# Altium schematic sheet Pizza IO.SchDoc: Pizza CHALLENGES
size A4; Author: Giovanni Minotti; SheetNumber: 2; SheetTotal: 2
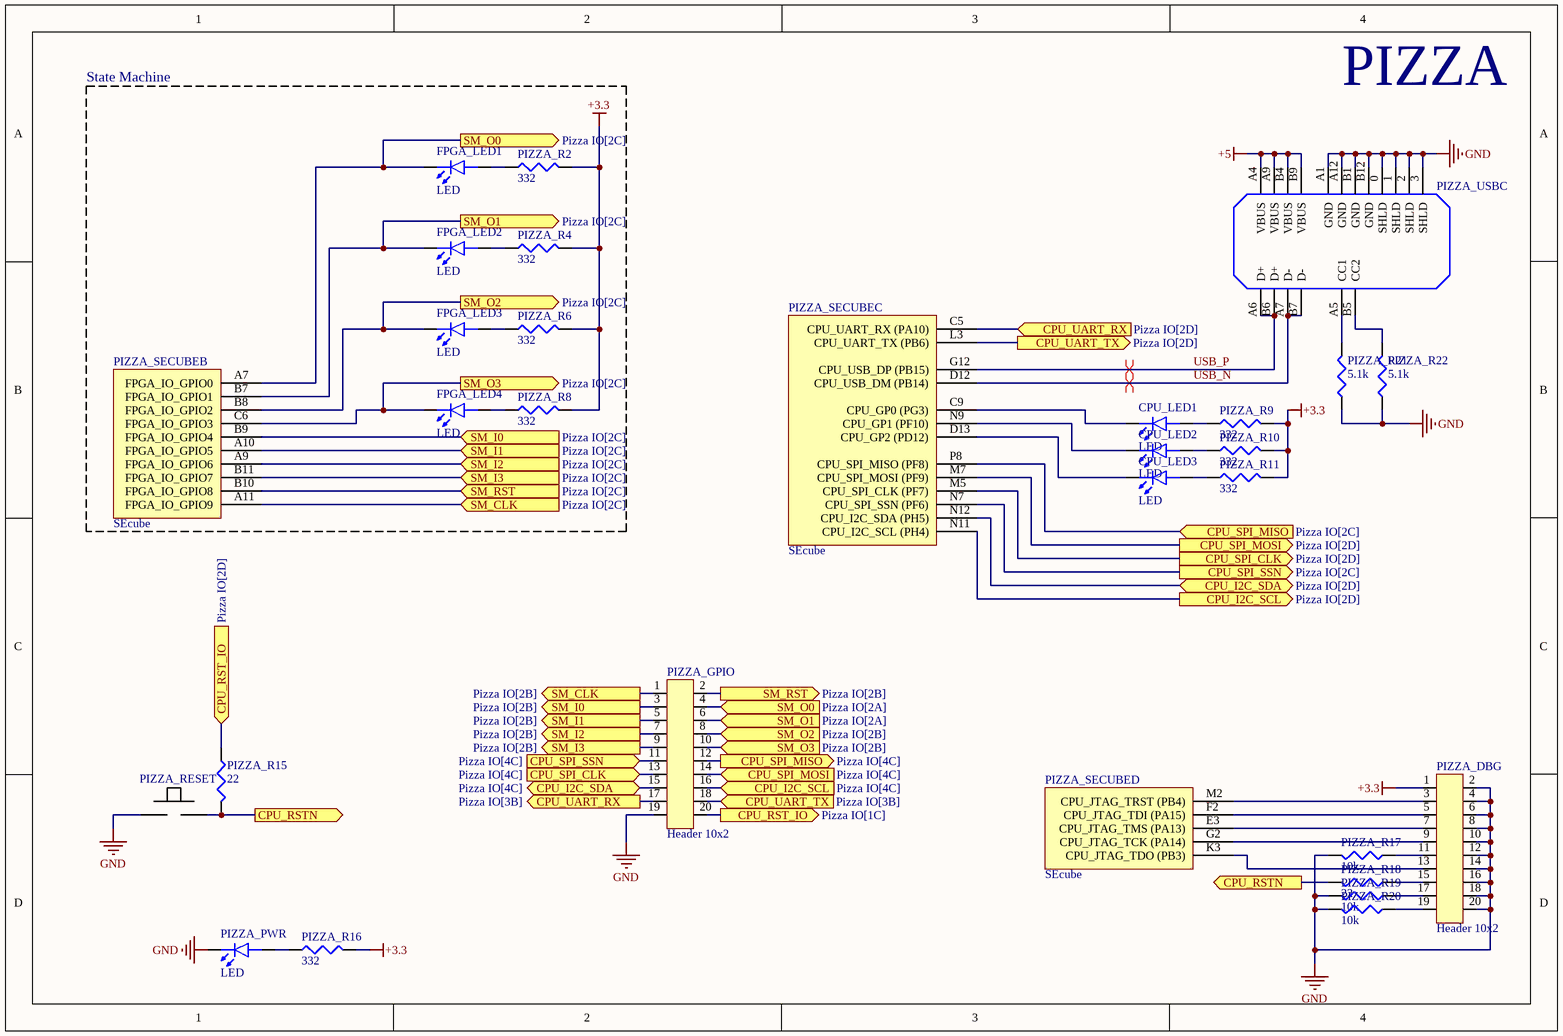
[diagram p0: Pizza IO.SchDoc]

## Parts
CPU_LED1  LED  [LED0603P]
CPU_LED2  LED  [LED0603P]
CPU_LED3  LED  [LED0603P]
FPGA_LED1  LED  [LED0603P]
FPGA_LED2  LED  [LED0603P]
FPGA_LED3  LED  [LED0603P]
FPGA_LED4  LED  [LED0603P]
PIZZA_DBG  Header 10x2  [HEADER10x2]
PIZZA_GPIO  Header 10x2  [HEADER10x2]
PIZZA_PWR  LED  [LED0603P]
PIZZA_R2  332  [R0402]
PIZZA_R4  332  [R0402]
PIZZA_R6  332  [R0402]
PIZZA_R8  332  [R0402]
PIZZA_R9  332  [R0402]
PIZZA_R10  332  [R0402]
PIZZA_R11  332  [R0402]
PIZZA_R15  22  [R0402]
PIZZA_R16  332  [R0402]
PIZZA_R17  10k  [R0402]
PIZZA_R18  22  [R0402]
PIZZA_R19  10k  [R0402]
PIZZA_R20  10k  [R0402]
PIZZA_R21  5.1k  [R0402]
PIZZA_R22  5.1k  [R0402]
PIZZA_RESET  BTN  [TS1088AR02016]  (value not drawn)
PIZZA_SECUBE  SEcube  [SEcube]  (parts B,C,D of 4)
PIZZA_USBC  USBC  [USB-TYPE-C-018]  (value not drawn)

## Blocks framed on the sheet
State Machine: FPGA_LED1-FPGA_LED4 PIZZA_R2 PIZZA_R4 PIZZA_R6 PIZZA_R8 PIZZA_SECUBE

## Ports
CPU_I2C_SCL (in, see Pizza IO[4C]), CPU_I2C_SCL (out, see Pizza IO[2D]), CPU_I2C_SDA (bidir, see Pizza IO[2D]), CPU_I2C_SDA (bidir, see Pizza IO[4C]), CPU_RST_IO (in, see Pizza IO[2D]), CPU_RST_IO (out, see Pizza IO[1C]), CPU_RSTN (out, see Pizza BASE[3B], Pizza IO[1D]), CPU_RSTN (out, see Pizza BASE[3B], Pizza IO[4D]), CPU_SPI_CLK (in, see Pizza IO[4C]), CPU_SPI_CLK (out, see Pizza IO[2D]), CPU_SPI_MISO (in, see Pizza IO[2C]), CPU_SPI_MISO (out, see Pizza IO[4C]), CPU_SPI_MOSI (in, see Pizza IO[4C]), CPU_SPI_MOSI (out, see Pizza IO[2D]), CPU_SPI_SSN (in, see Pizza IO[4C]), CPU_SPI_SSN (out, see Pizza IO[2C]), CPU_UART_RX (in, see Pizza IO[2D]), CPU_UART_RX (out, see Pizza IO[3B]), CPU_UART_TX (in, see Pizza IO[3B]), CPU_UART_TX (out, see Pizza IO[2D]), SM_CLK (in, see Pizza IO[2C]), SM_CLK (out, see Pizza IO[2B]), SM_I0 (in, see Pizza IO[2C]), SM_I0 (out, see Pizza IO[2B]), SM_I1 (in, see Pizza IO[2C]), SM_I1 (out, see Pizza IO[2B]), SM_I2 (in, see Pizza IO[2C]), SM_I2 (out, see Pizza IO[2B]), SM_I3 (in, see Pizza IO[2C]), SM_I3 (out, see Pizza IO[2B]), SM_O0 (in, see Pizza IO[2A]), SM_O0 (out, see Pizza IO[2C]), SM_O1 (in, see Pizza IO[2A]), SM_O1 (out, see Pizza IO[2C]), SM_O2 (in, see Pizza IO[2B]), SM_O2 (out, see Pizza IO[2C]), SM_O3 (in, see Pizza IO[2B]), SM_O3 (out, see Pizza IO[2C]), SM_RST (in, see Pizza IO[2C]), SM_RST (out, see Pizza IO[2B])

## Nets
+3.3: PIZZA_DBG.1 PIZZA_R2.2 PIZZA_R4.2 PIZZA_R6.2 PIZZA_R8.2 PIZZA_R9.2 PIZZA_R10.2 PIZZA_R11.2 PIZZA_R16.2
+5: PIZZA_USBC.A4(VBUS) PIZZA_USBC.A9(VBUS) PIZZA_USBC.B4(VBUS) PIZZA_USBC.B9(VBUS)
GND: PIZZA_DBG.2 PIZZA_DBG.4 PIZZA_DBG.6 PIZZA_DBG.8 PIZZA_DBG.10 PIZZA_DBG.12 PIZZA_DBG.14 PIZZA_DBG.16 PIZZA_DBG.18 PIZZA_DBG.20 PIZZA_GPIO.19 PIZZA_PWR.2(K) PIZZA_R17.2 PIZZA_R19.2 PIZZA_R20.2 PIZZA_R21.1 PIZZA_R22.1 PIZZA_RESET.1 PIZZA_USBC.0(SHLD) PIZZA_USBC.1(SHLD) PIZZA_USBC.2(SHLD) PIZZA_USBC.3(SHLD) PIZZA_USBC.A1(GND) PIZZA_USBC.A12(GND) PIZZA_USBC.B1(GND) PIZZA_USBC.B12(GND)
CPU_I2C_SCL: PIZZA_GPIO.16 PIZZA_SECUBE.N11(CPU_I2C_SCL_(PH4)) ; port CPU_I2C_SCL
CPU_I2C_SDA: PIZZA_GPIO.15 PIZZA_SECUBE.N12(CPU_I2C_SDA_(PH5)) ; port CPU_I2C_SDA
CPU_RST_IO: PIZZA_GPIO.20 PIZZA_R15.1 ; port CPU_RST_IO
CPU_RSTN: PIZZA_R15.2 PIZZA_R18.2 PIZZA_RESET.2 ; port CPU_RSTN
CPU_SPI_CLK: PIZZA_GPIO.13 PIZZA_SECUBE.M5(CPU_SPI_CLK_(PF7)) ; port CPU_SPI_CLK
CPU_SPI_MISO: PIZZA_GPIO.12 PIZZA_SECUBE.P8(CPU_SPI_MISO_(PF8)) ; port CPU_SPI_MISO
CPU_SPI_MOSI: PIZZA_GPIO.14 PIZZA_SECUBE.M7(CPU_SPI_MOSI_(PF9)) ; port CPU_SPI_MOSI
CPU_SPI_SSN: PIZZA_GPIO.11 PIZZA_SECUBE.N7(CPU_SPI_SSN_(PF6)) ; port CPU_SPI_SSN
CPU_UART_RX: PIZZA_GPIO.17 PIZZA_SECUBE.C5(CPU_UART_RX_(PA10)) ; port CPU_UART_RX
CPU_UART_TX: PIZZA_GPIO.18 PIZZA_SECUBE.L3(CPU_UART_TX_(PB6)) ; port CPU_UART_TX
SM_CLK: PIZZA_GPIO.1 PIZZA_SECUBE.A11(FPGA_IO_GPIO9) ; port SM_CLK
SM_I0: PIZZA_GPIO.3 PIZZA_SECUBE.B9(FPGA_IO_GPIO4) ; port SM_I0
SM_I1: PIZZA_GPIO.5 PIZZA_SECUBE.A10(FPGA_IO_GPIO5) ; port SM_I1
SM_I2: PIZZA_GPIO.7 PIZZA_SECUBE.A9(FPGA_IO_GPIO6) ; port SM_I2
SM_I3: PIZZA_GPIO.9 PIZZA_SECUBE.B11(FPGA_IO_GPIO7) ; port SM_I3
SM_O0: FPGA_LED1.2(K) PIZZA_GPIO.4 PIZZA_SECUBE.A7(FPGA_IO_GPIO0) ; port SM_O0
SM_O1: FPGA_LED2.2(K) PIZZA_GPIO.6 PIZZA_SECUBE.B7(FPGA_IO_GPIO1) ; port SM_O1
SM_O2: FPGA_LED3.2(K) PIZZA_GPIO.8 PIZZA_SECUBE.B8(FPGA_IO_GPIO2) ; port SM_O2
SM_O3: FPGA_LED4.2(K) PIZZA_GPIO.10 PIZZA_SECUBE.C6(FPGA_IO_GPIO3) ; port SM_O3
SM_RST: PIZZA_GPIO.2 PIZZA_SECUBE.B10(FPGA_IO_GPIO8) ; port SM_RST
USB_N: PIZZA_SECUBE.D12(CPU_USB_DM_(PB14)) PIZZA_USBC.A7(D-) PIZZA_USBC.B7(D-)
USB_P: PIZZA_SECUBE.G12(CPU_USB_DP_(PB15)) PIZZA_USBC.A6(D+) PIZZA_USBC.B6(D+)
NetCPU_LED1_1: CPU_LED1.1(A) PIZZA_R9.1
NetCPU_LED1_2: CPU_LED1.2(K) PIZZA_SECUBE.C9(CPU_GP0_(PG3))
NetCPU_LED2_1: CPU_LED2.1(A) PIZZA_R10.1
NetCPU_LED2_2: CPU_LED2.2(K) PIZZA_SECUBE.N9(CPU_GP1_(PF10))
NetCPU_LED3_1: CPU_LED3.1(A) PIZZA_R11.1
NetCPU_LED3_2: CPU_LED3.2(K) PIZZA_SECUBE.D13(CPU_GP2_(PD12))
NetFPGA_LED1_1: FPGA_LED1.1(A) PIZZA_R2.1
NetFPGA_LED2_1: FPGA_LED2.1(A) PIZZA_R4.1
NetFPGA_LED3_1: FPGA_LED3.1(A) PIZZA_R6.1
NetFPGA_LED4_1: FPGA_LED4.1(A) PIZZA_R8.1
NetPIZZA_DBG_3: PIZZA_DBG.3 PIZZA_SECUBE.M2(CPU_JTAG_TRST_(PB4))
NetPIZZA_DBG_5: PIZZA_DBG.5 PIZZA_SECUBE.F2(CPU_JTAG_TDI_(PA15))
NetPIZZA_DBG_7: PIZZA_DBG.7 PIZZA_SECUBE.E3(CPU_JTAG_TMS_(PA13))
NetPIZZA_DBG_9: PIZZA_DBG.9 PIZZA_SECUBE.G2(CPU_JTAG_TCK_(PA14))
NetPIZZA_DBG_11: PIZZA_DBG.11 PIZZA_R17.1
NetPIZZA_DBG_13: PIZZA_DBG.13 PIZZA_SECUBE.K3(CPU_JTAG_TDO_(PB3))
NetPIZZA_DBG_15: PIZZA_DBG.15 PIZZA_R18.1
NetPIZZA_DBG_17: PIZZA_DBG.17 PIZZA_R19.1
NetPIZZA_DBG_19: PIZZA_DBG.19 PIZZA_R20.1
NetPIZZA_PWR_1: PIZZA_PWR.1(A) PIZZA_R16.1
NetPIZZA_R21_2: PIZZA_R21.2 PIZZA_USBC.A5(CC1)
NetPIZZA_R22_2: PIZZA_R22.2 PIZZA_USBC.B5(CC2)

## Layout directives
differential pair: USB_N, USB_P

## Notes on the sheet
- PIZZA

## Library data of the parts
PIZZA_R2 PIZZA_R4 PIZZA_R6 PIZZA_R8-PIZZA_R11 PIZZA_R15-PIZZA_R22 = R